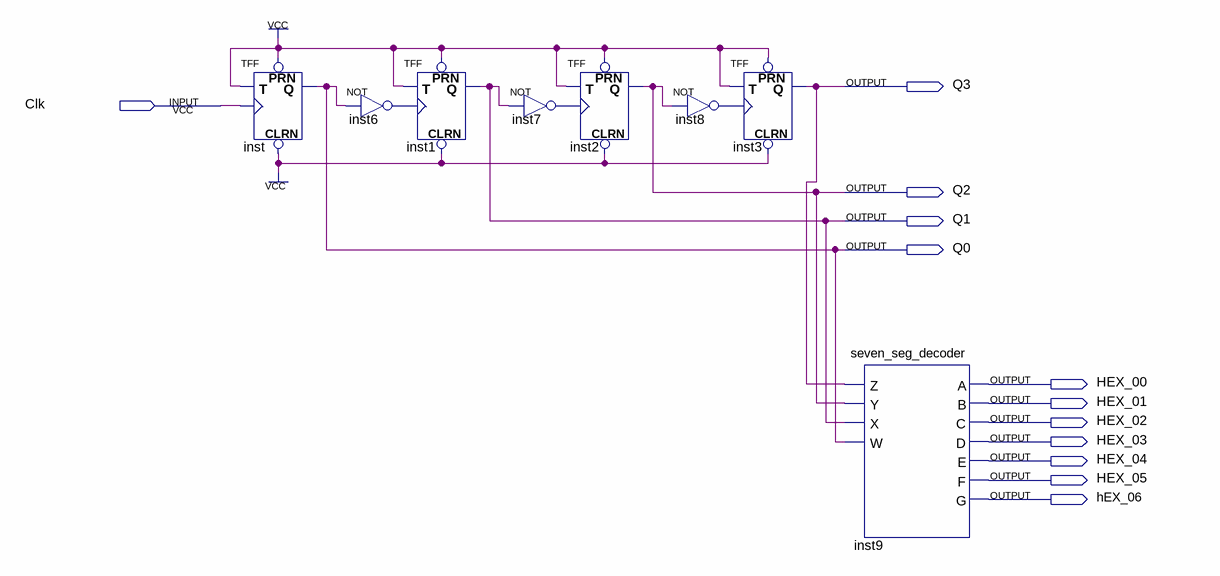
[diagram p0: schematic sheet]
// Quartus schematic lab10step3a.bdf as structural Verilog: 8 symbols, 12 pins
module lab10step3a (
  input  Clk,
  output Q3,
  output Q2,
  output Q1,
  output Q0,
  output HEX_00,
  output HEX_01,
  output HEX_02,
  output HEX_03,
  output HEX_04,
  output HEX_05,
  output hEX_06
);

  wire inst6_out, inst7_out, inst8_out;

  TFF inst (.PRN(1'b1), .CLRN(1'b1), .T(1'b1), .CLK(Clk), .Q(Q0));
  not inst6 (inst6_out, Q0);
  TFF inst1 (.PRN(1'b1), .CLRN(1'b1), .T(1'b1), .CLK(inst6_out), .Q(Q1));
  not inst7 (inst7_out, Q1);
  TFF inst2 (.PRN(1'b1), .CLRN(1'b1), .T(1'b1), .CLK(inst7_out), .Q(Q2));
  TFF inst3 (.PRN(1'b1), .CLRN(1'b1), .T(1'b1), .CLK(inst8_out), .Q(Q3));
  not inst8 (inst8_out, Q2);
  seven_seg_decoder inst9 (
    .Z(Q3), .Y(Q2), .X(Q1), .W(Q0), .A(HEX_00), .B(HEX_01), .C(HEX_02), .D(HEX_03), .E(HEX_04), .F(HEX_05),
    .G(hEX_06));
endmodule
